# EAGLE design 01 (EAGLE 7.2.0)
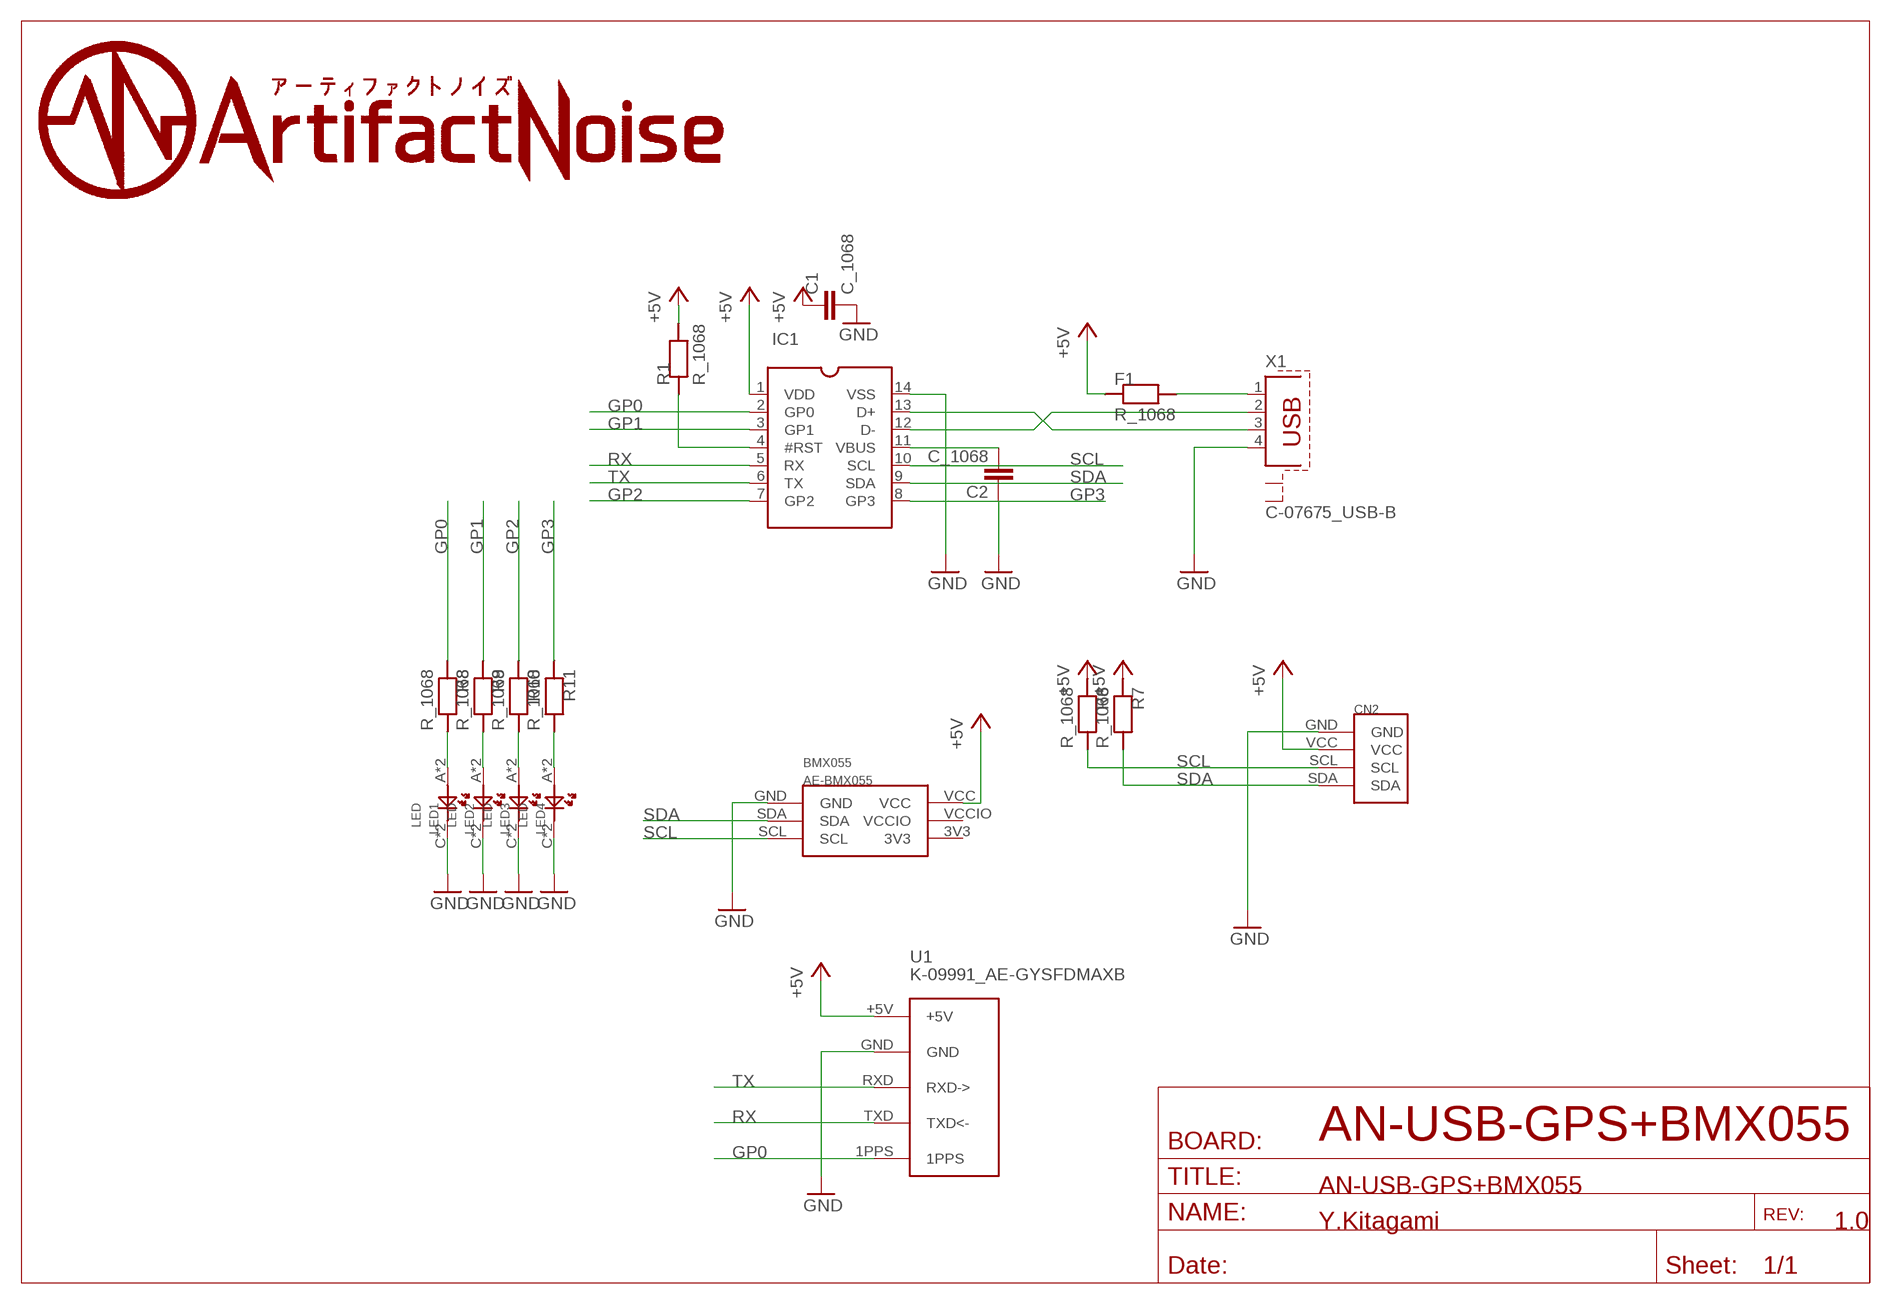
[diagram p0: schematic, sheet 1]

## Parts
BMX055  AE-BMX055  [AE-BMX055]
C1  C_1068  [C0603]
C2  C_1068  [C0603]
CN2  PIN4  [PIN4]
F1  R_1068  [R0603]
IC1  _MCP2221A-I/PS  [SOCKET-14]
LED1  LED  [CHIPLED_0805]
LED2  LED  [CHIPLED_0805]
LED3  LED  [CHIPLED_0805]
LED4  LED  [CHIPLED_0805]
R1  R_1068  [R0603]
R6  R_1068  [R0603]
R7  R_1068  [R0603]
R8  R_1068  [R0603]
R9  R_1068  [R0603]
R10  R_1068  [R0603]
R11  R_1068  [R0603]
U1  K-09991_AE-GYSFDMAXB  [AE-GYSFDMAXB]
X1  C-07675_USB-B  [PN61729-S]

## Nets
+5V: BMX055.VCC C1.1 C1.D1 CN2.VCC F1.1 F1.D1 IC1.1(VDD) R1.2 R1.D2 R6.1 R6.D1 R7.1 R7.D1 U1.+5V
GND: BMX055.GND C1.2 C1.D2 C2.1 C2.D1 CN2.GND IC1.14(VSS) LED1.C LED1.DC(C) LED2.C LED2.DC(C) LED3.C LED3.DC(C) LED4.C LED4.DC(C) U1.GND X1.4
GP0: IC1.2(GP0) R8.1 R8.D1 U1.1PPS
GP1: IC1.3(GP1) R9.1 R9.D1
GP2: IC1.7(GP2) R10.1 R10.D1
GP3: IC1.8(GP3) R11.1 R11.D1
N$1: IC1.4(#RST) R1.1 R1.D1
N$2: IC1.13(D+) X1.3
N$3: IC1.12(D-) X1.2
N$4: C2.2 C2.D2 IC1.11(VBUS)
N$5: F1.2 F1.D2 X1.1
N$9: LED1.A LED1.DA(A) R8.2 R8.D2
N$10: LED2.A LED2.DA(A) R9.2 R9.D2
N$11: LED3.A LED3.DA(A) R10.2 R10.D2
N$12: LED4.A LED4.DA(A) R11.2 R11.D2
RX: IC1.5(RX) U1.TXD(TXD<-)
SCL: BMX055.SCL CN2.SCL IC1.10(SCL) R6.2 R6.D2
SDA: BMX055.SDA CN2.SDA IC1.9(SDA) R7.2 R7.D2
TX: IC1.6(TX) U1.RXD(RXD->)
Unconnected: BMX055.3V3 BMX055.VCCIO X1.S1 X1.S2

## Notes on the sheet
- AN-USB-GPS+BMX055
- AN-USB-GPS+BMX055
- Y.Kitagami | 1.0

## Library data of the parts
BMX055 = 01:AE-BMX055
C1 C2 = 01:C_1068
CN2 = 01:PIN4
F1 R1 R6-R11 = 01:R_1068
IC1 = 01:_MCP2221A-I/P: Dual In Line / Socket
LED1-LED4 = 01:LED
U1 = 01:K-09991_AE-GYSFDMAXB: ＧＰＳ受信機キット １ＰＰＳ出力付き 「みちびき」対応 [AE-GYSFDMAXB] 通販コード K-09991 発売日 2016/02/06 メーカーカテゴリ 株式会社秋月電子通商 太陽誘電製の小型高感度ＧＰＳモジュールＧＹＳＦＤＭＡＸＢを使用したＧＰＳ受信機キットです。 ＮＭＥＡ０１８３に準拠した緯度・経度・高度・時刻などの各種ナビゲーション情報をシリアル信号で出力します。 ＧＰＳ衛星追尾中（三次元測位中）は正確な１ＰＰＳ（１秒）信号を出力します。 ＮＭＥＡセンテンス更新回数を毎秒１０回（最大）にすることができます。 専用ＧＵＩソフトによって、通信速度やＮＭＥＡフォーマットのセンテンスを設定することができます。日本の準天頂衛星システム（ＱＺＳＳ）「みちびき」に対応しています。
X1 = 01:C-07675_USB-B: BERG USB connector; OC_FARNELL: unknown; OC_NEWARK: unknown

## Board
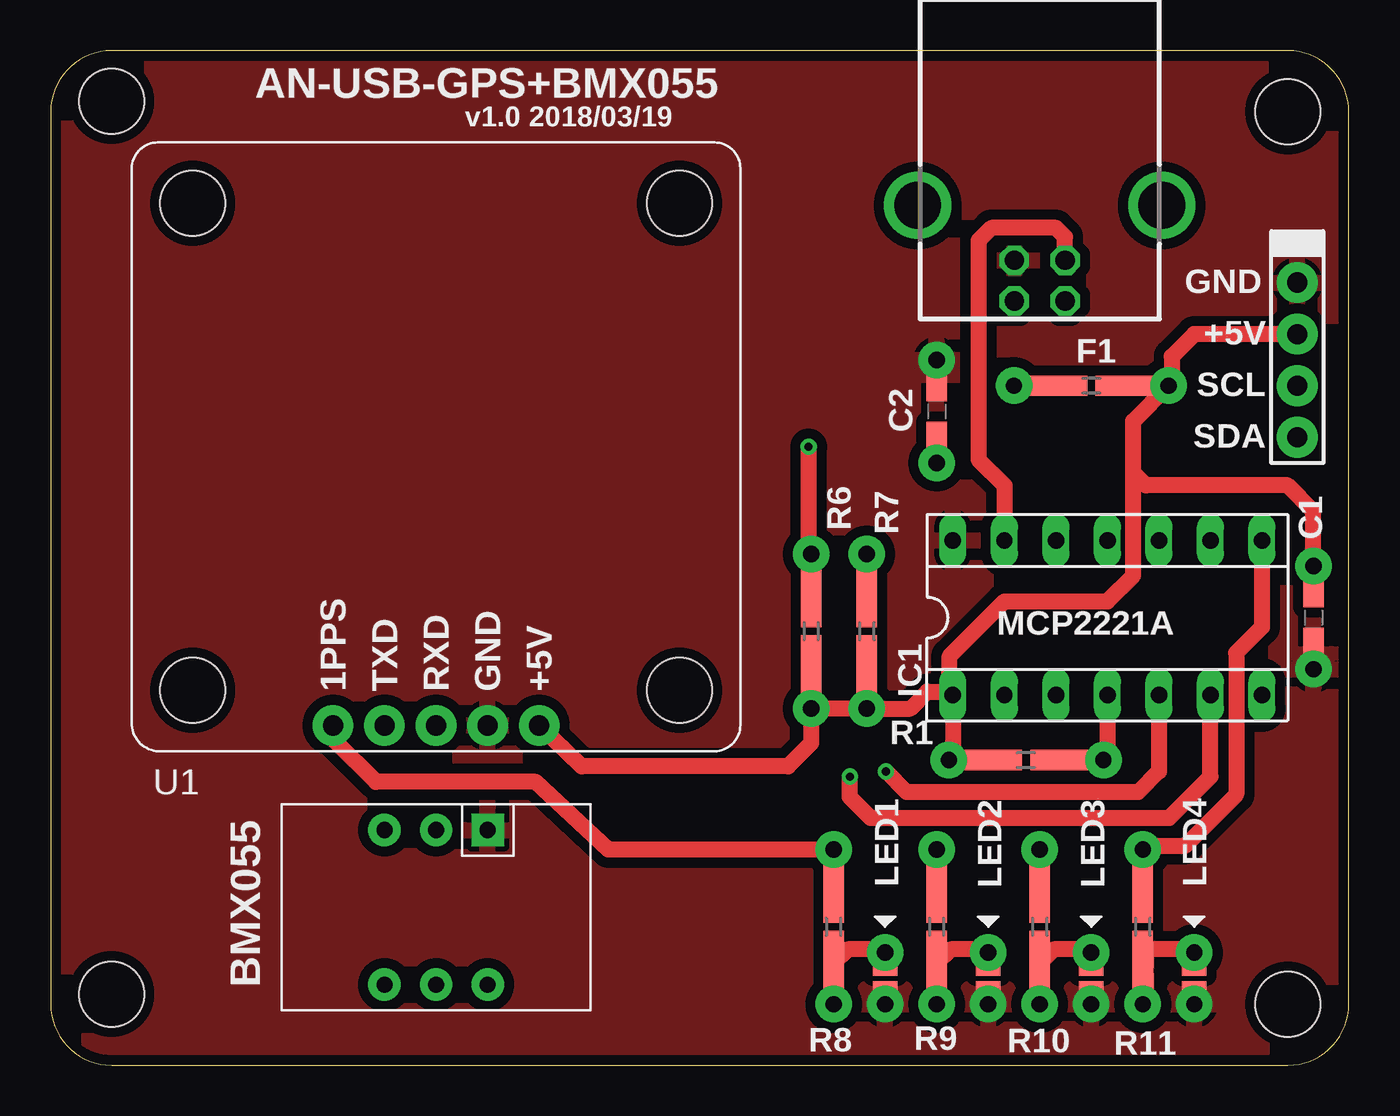
[diagram p1: board, top side]
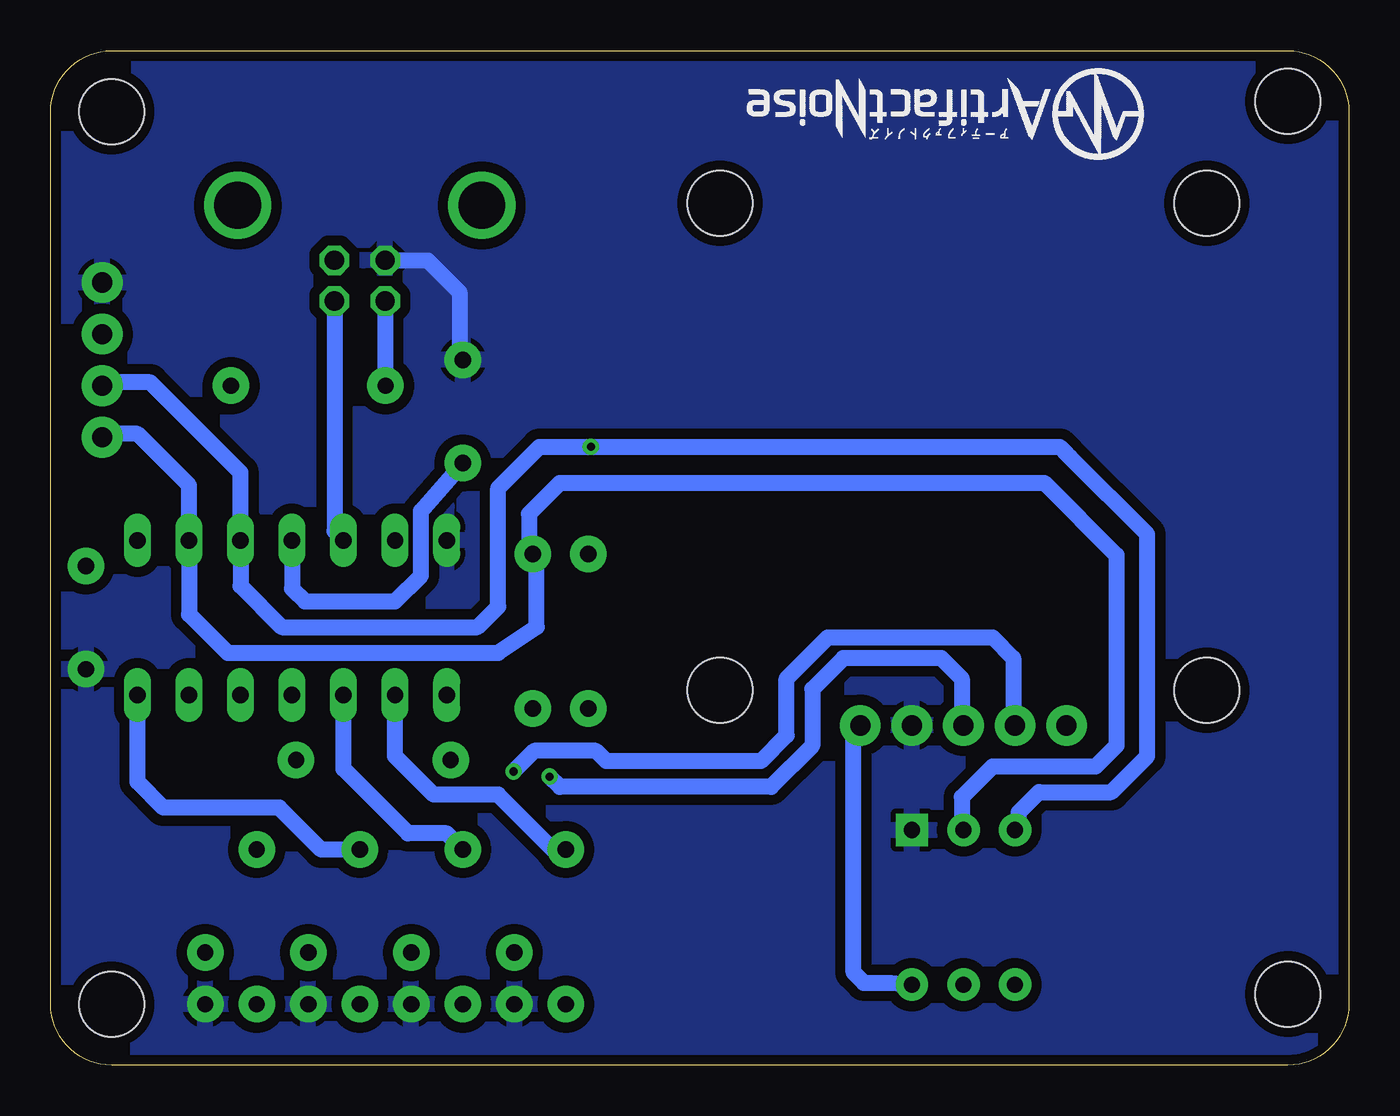
[diagram p2: board, bottom side, seen from below]

Size 64 x 50 mm. Coordinates in mm from the lower left corner, seen from the top.
Outline: 64,3 64,47 arc90 61,50 3,50 arc90 0,47 0,3 arc90 3,0 61,0 arc90 64,3
Copper layers (1*16): Top 0.035mm / dielectric 1.5mm / Bottom 0.035mm
Design rules "SeeedStudio_2layer_DRU_no_angle_20140221a": minimum track width 6mil, minimum drill 12mil, track to track 6mil, track to pad 6mil, pad to pad 6mil, via to via 6mil, smd to smd 0mil, copper to edge 10mil, drill to drill 10mil, minimum pad ring 10mil, minimum via ring 6mil, stop-mask expansion 2mil, vias tented up to drill 25mil, thermal gap 10mil
Holes 3.2 mm at 61,47 3,47.51 3,3.51 61,3

### Footprints (pad centres in the part's own frame; a part is rotated, then mirrored left to right if it is on the bottom)
AE-BMX055 = drill 0.8 pad 1.6: 3V3 3.81,-2.54; SCL -3.81,-2.54; SDA -3.81,0; VCC 3.81,2.54; VCCIO 3.81,0 | drill 0.8 pad 1.6 square: GND -3.81,2.54
C0603 = smd 2.6 x 1: 1 -1.8,0; 2 1.8,0 | drill 0.8 pad 1.8: D1 -2.54,0; D2 2.54,0
PIN4 = drill 1 pad 2: GND 0,-3.81; SCL 0,1.27; SDA 0,3.81; VCC 0,-1.27
R0603 = smd 3.2 x 1: 1 -1.8,0; 2 1.8,0 | drill 0.8 pad 1.8: D1 -3.81,0; D2 3.81,0
SOCKET-14 = drill 0.813 long: 1 -7.62,-3.81; 2 -5.08,-3.81; 3 -2.54,-3.81; 4 0,-3.81; 5 2.54,-3.81; 6 5.08,-3.81; 7 7.62,-3.81; 8 7.62,3.81; 9 5.08,3.81; 10 2.54,3.81; 11 0,3.81; 12 -2.54,3.81; 13 -5.08,3.81; 14 -7.62,3.81
CHIPLED_0805 = smd 1.2 x 0.8: A 0,-1.8; C 0,-0.74 | drill 0.8 pad 1.8: DA 0,-2.54; DC 0,0
AE-GYSFDMAXB = drill 1 pad 2: 1PPS 5.08,13.73; +5V -5.08,13.73; GND -2.54,13.73; RXD 0,13.73; TXD 2.54,13.73 | hole 3.2: -12,12; 12,12; 12,-12; -12,-12
PN61729-S = drill 0.95 octagon: 1 1.25,4.71; 2 -1.25,4.71; 3 -1.25,2.71; 4 1.25,2.71 | drill 2.3 pad 2.9: S1 -6.02,0; S2 6.02,0

### Placement (x,y rotation side)
BMX055  19,7.78 270 top
C1  62.26,22.06 270 top
C2  43.68,32.22 270 top
CN2  61.46,34.76 180 top
F1  51.3,33.49 180 top
IC1  52.1,22.06 0 top
LED1  41.14,3.01 180 top
LED2  46.22,3.01 180 top
LED3  51.3,3.01 180 top
LED4  56.38,3.01 180 top
R1  48.09,15.04 180 top
R6  37.5,21.39 90 top
R7  40.23,21.39 90 top
R8  38.6,6.82 270 top
R9  43.68,6.82 270 top
R10  48.76,6.82 270 top
R11  53.84,6.82 270 top
U1  19,30.48 180 top
U$1  [AN-LOGO2]  10.12,49.12 180 bottom
X1  48.76,42.38 180 top

### Tracks (layer width: path | path; a pad name or v marks a point on that pad's centre or on a via)
+5V
  Top 0.406: R6.1 R6.D1 | R7.1 R7.D1 | R1.2 R1.D2
  Top 0.8: F1.1 F1.D1 | CN2.VCC 56.38,36.03 55.27,34.92 55.27,33.66 F1.D1 | R1.D2 44.48,15.24 IC1.1 44.31,18.41 | 44.31,18.41 43.21,18.41 42.38,17.58 R7.D1 R6.D1 37.5,15.88 36.35,14.73 26.18,14.73 U1.+5V | C1.1 C1.D1 62.26,27.3 60.99,28.57 54.01,28.57 53.37,29.21 | 44.31,18.41 44.31,20.16 47.02,22.86 52.1,22.86 53.37,24.13 53.37,29.21 | 53.37,29.21 53.37,31.75 F1.D1
  Bottom 0.8: BMX055.VCC 22.58,4.06 23.91,4.06 24.41,4.57 24.41,16.42 U1.+5V
GND
  Top 0.8: LED4.C LED4.DC
  Bottom 0.8: X1.4 45.41,39.67 43.84,38.1 43.84,34.92 C2.D1
  pour Top (isolate 0.5): 65.27,-0.8 -3.31,-0.8 -3.31,51.27 65.27,51.27
  pour Bottom (isolate 0.5): 65.27,-0.8 -3.31,-0.55 -3.31,51.52 65.27,51.27
GP0
  Top 0.406: R8.1 R8.D1
  Top 0.8: R8.D1 27.5,10.63 23.91,13.97 16.03,13.97 14,16 U1.1PPS
  Bottom 0.8: R8.D1 39.23,10.63 41.94,13.34 45.11,13.34 47.02,15.24 IC1.2
GP1
  Top 0.406: R9.1 R9.D1
  Bottom 0.8: R9.D1 44.48,11.43 46.38,11.43 49.56,14.61 IC1.3
GP2
  Top 0.406: R10.1 R10.D1
  Bottom 0.8: R10.D1 50.66,10.63 52.73,12.7 58.45,12.7 59.72,13.97 IC1.7
GP3
  Top 0.406: R11.1 R11.D1
  Top 0.8: IC1.8 59.72,21.59 58.45,20.32 58.45,13.34 55.91,10.79 54.01,10.79 R11.D1
N$1
  Top 0.406: R1.1 R1.D1
  Top 0.8: IC1.4 52.1,15.24 R1.D1
N$2
  Top 0.8: X1.3 50.01,40.83 49.56,41.27 46.38,41.27 45.75,40.64 45.75,29.84 47.02,28.57 IC1.13
N$3
  Bottom 0.8: X1.2 50.01,26.32 IC1.12
N$4
  Top 0.406: C2.D2 C2.2
  Bottom 0.8: IC1.11 52.1,23.5 51.47,22.86 47.02,22.86 45.75,24.13 45.75,27.3 C2.D2
N$5
  Top 0.8: F1.D2 F1.2
  Bottom 0.8: X1.1 47.51,33.51 F1.D2
N$9
  Top 0.8: LED1.A LED1.DA 41.3,5.71 39.3,5.71 R8.2 R8.D2
N$10
  Top 0.8: LED2.A LED2.DA 46.38,5.71 44.38,5.71 R9.2 R9.D2
N$11
  Top 0.8: LED3.A LED3.DA 51.47,5.71 49.45,5.71 R10.2 48.76,3.98 48.92,3.17 R10.D2
N$12
  Top 0.8: LED4.A LED4.DA 56.55,5.71 54.01,5.71 54.01,4.86 | R11.D2 54.01,3.17 54.01,4.45 54.01,4.86 | 54.01,4.86 R11.2
RX  (via drill 0.4 pad 0.8)
  Top 0.8: IC1.5 54.64,14.48 53.62,13.46 42.19,13.46 v41.18,14.48
  Bottom 0.8: v41.18,14.48 40.16,15.49 37.11,15.49 36.61,14.99 28.99,14.99 27.72,16.26 27.72,19.05 25.68,21.08 17.56,21.08 16.54,20.07 16.54,16.83 U1.TXD
SCL  (via drill 0.4 pad 0.8)
  Top 0.406: R6.2 R6.D2
  Top 0.8: v37.37,30.48 37.37,25.33 R6.D2
  Bottom 0.8: CN2.SCL 61.3,33.66 59.09,33.66 54.64,29.21 IC1.10 54.64,23.62 52.61,21.59 42.96,21.59 41.94,22.61 41.94,28.45 39.91,30.48 v37.37,30.48 14.25,30.48 13.75,29.97 | 13.75,29.97 9.94,26.16 9.94,15.24 11.71,13.46 15.27,13.46 16.29,12.45 16.29,11.76 BMX055.SCL | 13.75,29.97 14,30.23
SDA
  Top 0.406: R7.2 R7.D2
  Bottom 0.8: CN2.SDA 61.3,31.11 59.72,31.11 57.18,28.57 IC1.9 57.18,22.23 55.27,20.32 41.94,20.32 40.03,21.59 40.03,25 R7.D2 40.42,25.38 40.42,27.18 38.89,28.7 15.02,28.7 11.46,25.15 11.46,15.75 12.48,14.73 17.56,14.73 19.08,13.21 19.08,11.67 BMX055.SDA
TX  (via drill 0.4 pad 0.8)
  Top 0.8: IC1.6 57.18,14.22 55.15,12.19 40.42,12.19 39.4,13.21 v39.4,14.22
  Bottom 0.8: v39.4,14.22 38.89,13.72 28.48,13.72 26.45,15.75 26.45,18.54 24.92,20.07 20.1,20.07 19.08,19.05 19.08,16.83 U1.RXD

### Text on the board
tPlace: AN-USB-GPS+BMX055 | v1.0 2018/03/19 | GND | +5V | SCL | SDA | MCP2221A